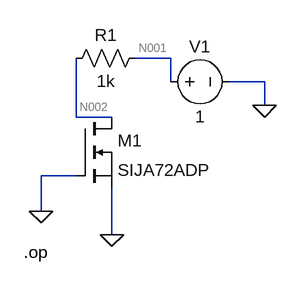
[diagram p0: schematic Draft4.asc]
Draft4.asc, the LTspice schematic file:
Version 4.1
SHEET 1 880 680
WIRE 336 48 288 48
WIRE 336 80 336 48
WIRE 464 80 416 80
WIRE 464 112 464 80
WIRE 208 128 208 48
WIRE 256 128 208 128
WIRE 208 208 160 208
WIRE 160 256 160 208
WIRE 256 288 256 224
FLAG 160 256 0
FLAG 256 288 0
FLAG 464 112 0
SYMBOL nmos 208 128 R0
SYMATTR InstName M1
SYMATTR Value SIJA72ADP
SYMBOL voltage 320 80 R270
WINDOW 0 32 56 VTop 2
WINDOW 3 -32 56 VBottom 2
WINDOW 123 0 0 Left 0
WINDOW 39 0 0 Left 0
SYMATTR InstName V1
SYMATTR Value 1
SYMBOL res 304 32 R90
WINDOW 0 0 56 VBottom 2
WINDOW 3 32 56 VTop 2
SYMATTR InstName R1
SYMATTR Value 1k
TEXT 136 312 Left 2 !.op

The netlist it stands for:
* Draft4.asc
M1 N002 0 0 0 SIJA72ADP
V1 N001 0 1
R1 N001 N002 1k
.model NMOS NMOS
.model PMOS PMOS
.lib standard.mos
.op
.backanno
.end

* Results of the author's LTspice run, read from the files saved beside the schematic
* Operating Point:
*   V(n001) = 1 V
*   V(n002) = 1 V
*   Id(M1) = 93.52 pA
*   Ig(M1) = -92.49 pA
*   Is(M1) = -1.029 pA
*   I(R1) = 1.979 pA
*   I(V1) = -1.979 pA